# EAGLE design megamon (EAGLE 9.6.2)
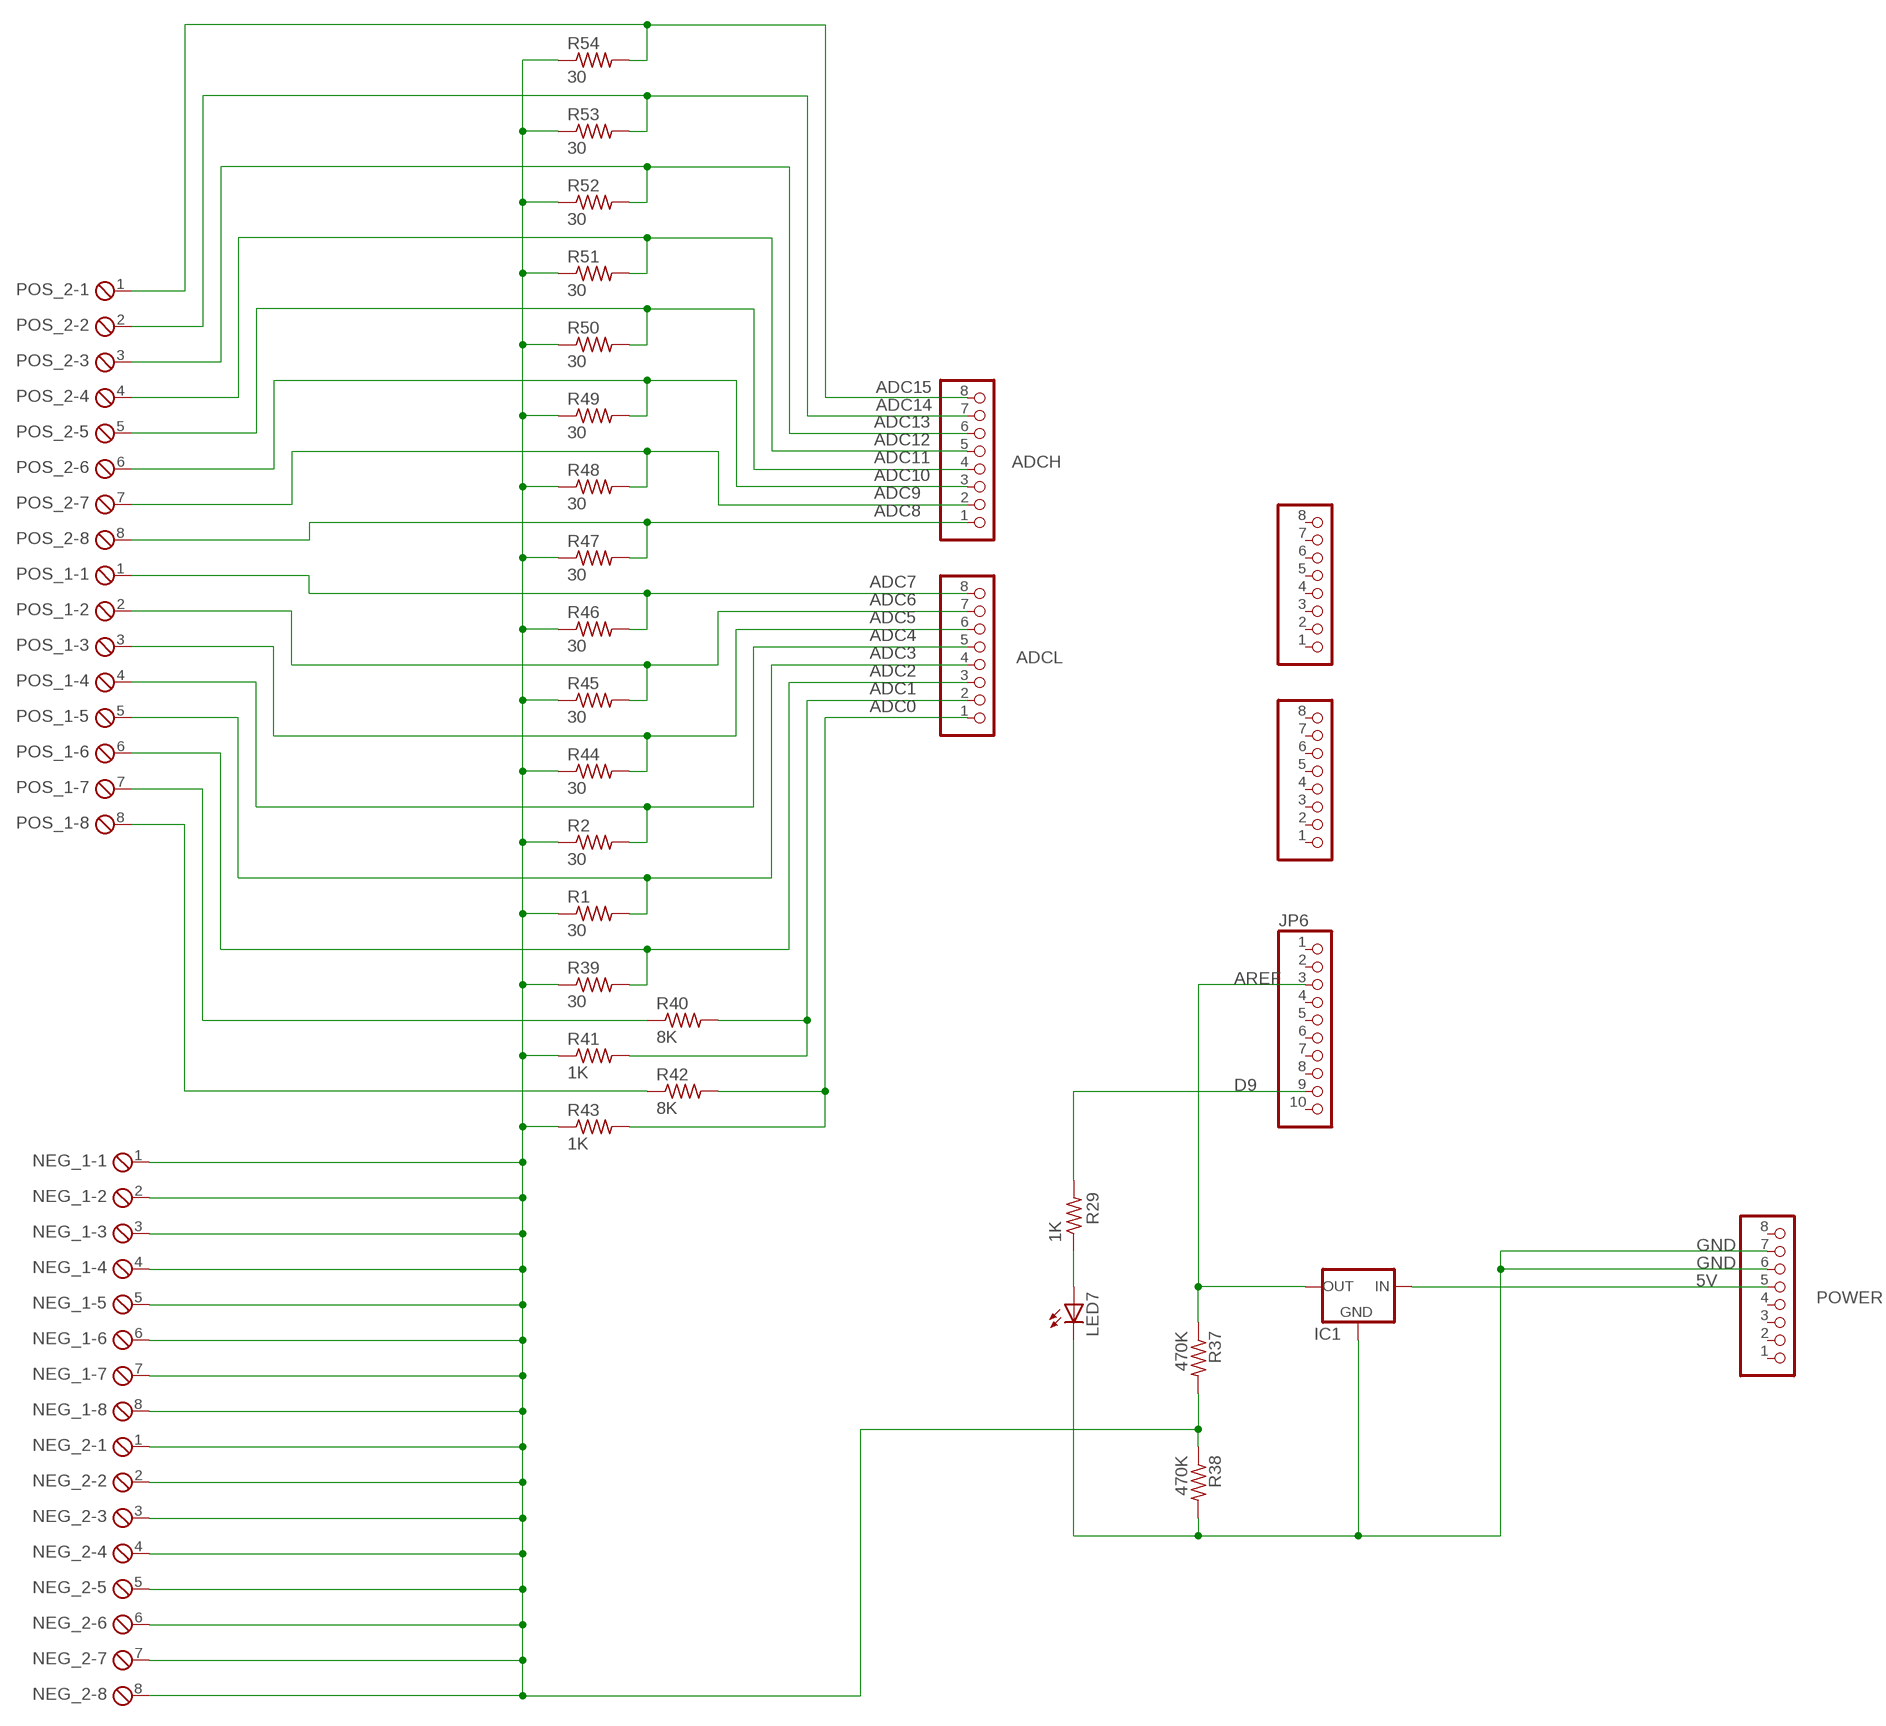
[diagram p0: schematic, sheet 1]

## Parts
ADCH  PINHD-1X8  [1X08]
ADCL  PINHD-1X8  [1X08]
COMMUNICATION  FH254-108DF08500V  0058_FH254-108DF08500V  [1X08]
IC1  MCP1700INLINE  [TO92-INLINE]
JP6  FH254-110DF08500V  1216_FH254-110DF08500T30  [1X10]
LED7  green  LED3MM  [LED3MM]
NEG_1  MPT8  [8POL254]
NEG_2  MPT8  [8POL254]
POS_1  MPT8  [8POL254]
POS_2  MPT8  [8POL254]
POWER  PINHD-1X8  [1X08]
PWML  FH254-108DF08500V  1218_FH254-108DF08500T20  [1X08]
R1  30  R-US_0204/7  [0204/7]
R2  30  R-US_0204/7  [0204/7]
R29  1K  R-US_0204/7  [0204/7]
R37  470K  R-US_0204/7  [0204/7]
R38  470K  R-US_0204/7  [0204/7]
R39  30  R-US_0204/7  [0204/7]
R40  8K  R-US_0204/7  [0204/7]
R41  1K  R-US_0204/7  [0204/7]
R42  8K  R-US_0204/7  [0204/7]
R43  1K  R-US_0204/7  [0204/7]
R44  30  R-US_0204/7  [0204/7]
R45  30  R-US_0204/7  [0204/7]
R46  30  R-US_0204/7  [0204/7]
R47  30  R-US_0204/7  [0204/7]
R48  30  R-US_0204/7  [0204/7]
R49  30  R-US_0204/7  [0204/7]
R50  30  R-US_0204/7  [0204/7]
R51  30  R-US_0204/7  [0204/7]
R52  30  R-US_0204/7  [0204/7]
R53  30  R-US_0204/7  [0204/7]
R54  30  R-US_0204/7  [0204/7]

## Nets
5V [power usb]: IC1.2(IN) POWER.5
ADC0: ADCL.1 R42.2 R43.2
ADC1: ADCL.2 R40.2 R41.2
ADC2: ADCL.3 POS_1.6 R39.2
ADC3: ADCL.4 POS_1.5 R1.2
ADC4: ADCL.5 POS_1.4 R2.2
ADC5: ADCL.6 POS_1.3 R44.2
ADC6: ADCL.7 POS_1.2 R45.2
ADC7: ADCL.8 POS_1.1 R46.2
ADC8: ADCH.1 POS_2.8 R47.2
ADC9: ADCH.2 POS_2.7 R48.2
ADC10: ADCH.3 POS_2.6 R49.2
ADC11: ADCH.4 POS_2.5 R50.2
ADC12: ADCH.5 POS_2.4 R51.2
ADC13: ADCH.6 POS_2.3 R52.2
ADC14: ADCH.7 POS_2.2 R53.2
ADC15: ADCH.8 POS_2.1 R54.2
AREF: IC1.3(OUT) JP6.3 R37.1
D9: JP6.9 R29.2
GND: IC1.1(GND) LED7.K(C) POWER.6 POWER.7 R38.2
N$2: POS_1.7 R40.1
N$6: POS_1.8 R42.1
N$11: LED7.A R29.1
V_MID: NEG_1.1 NEG_1.2 NEG_1.3 NEG_1.4 NEG_1.5 NEG_1.6 NEG_1.7 NEG_1.8 NEG_2.1 NEG_2.2 NEG_2.3 NEG_2.4 NEG_2.5 NEG_2.6 NEG_2.7 NEG_2.8 R1.1 R2.1 R37.2 R38.1 R39.1 R41.1 R43.1 R44.1 R45.1 R46.1 R47.1 R48.1 R49.1 R50.1 R51.1 R52.1 R53.1 R54.1
Unconnected: COMMUNICATION.1 COMMUNICATION.2 COMMUNICATION.3 COMMUNICATION.4 COMMUNICATION.5 COMMUNICATION.6 COMMUNICATION.7 COMMUNICATION.8 JP6.1 JP6.2 JP6.4 JP6.5 JP6.6 JP6.7 JP6.8 JP6.10 POWER.1 POWER.2 POWER.3 POWER.4 POWER.8 PWML.1 PWML.2 PWML.3 PWML.4 PWML.5 PWML.6 PWML.7 PWML.8

## Library data of the parts
ADCH ADCL POWER = pinhead:PINHD-1X8: PIN HEADER
COMMUNICATION = Connettori:0058_FH254-108DF08500V: Female Connector strip for Arduino bases - 8x1 F V h 8,5 p2,54mm; MONTHLY_USAGE: _____; PART_NUMBER: FH254-108DF08500V; PRICE: _____; SUPPLIER: _____; TYPE: Connettori
IC1 = adafruit:MCP1700: VOLTAGE REGULATOR
JP6 = Connettori:1216_FH254-110DF08500T30: Female Connector strip for Arduino bases - 10x1 F V h 8,5 p2,54 serigrafato STRISCIA VUOTA; MONTHLY_USAGE: _____; PART_NUMBER: FH254-110DF08500T30; PRICE: _____; SUPPLIER: _____; TYPE: Connettori; VALUE: FH254-110DF08500T30
LED7 = adafruit:LED: LED OSRAM: - CHIPLED LG R971, LG N971, LY N971, LG Q971, LY Q971, LO R971, LY R971 LH N974, LH R974 LS Q976, LO Q976, LY Q976 LO Q996 - Hyper CHIPLED LW Q18S LB Q993, LB Q99A, LB R99A - SideLED LS A670, LO A670, LY A670, LG A670, LP A670 LB A673, LV A673, LT A673, LW A673 LH A674 LY A675 LS A676, LA A676, LO A676, LY A676, LW A676 LS A679, LY A679, LG A679 - Hyper Micro SIDELED® LS Y876, LA Y876, LO Y876, LY Y876 LT Y87S - SmartLED LW L88C, LW L88S LB L89C, LB L89S, LG L890 LS L89K, LO L89K, LY L89K LS L896, LA L896, LO L896, LY L896 - TOPLED LS T670, LO T670, LY T670, LG T670, LP T670 LSG T670, LSP T670, LSY T670, LOP T670, LYG T670 LG T671, LOG T671, LSG T671 LB T673, LV T673, LT T673, LW T673 LH T674 LS T676, LA T676, LO T676, LY T676, LB T676, LH T676, LSB T676, LW T676 LB T67C, LV T67C, LT T67C, LS T67K, LO T67K, LY T67K, LW E67C LS E67B, LA E67B, LO E67B, LY E67B, LB E67C, LV E67C, LT E67C LW T67C LS T679, LY T679, LG T679 LS T770, LO T770, LY T770, LG T770, LP T770 LB T773, LV T773, LT T773, LW T773 LH T774 LS E675, LA E675, LY E675, LS T675 LS T776, LA T776, LO T776, LY T776, LB T776 LHGB T686 LT T68C, LB T68C - Hyper Mini TOPLED® LB M676 - Mini TOPLED Santana® LG M470 LS M47K, LO M47K, LY M47K Source: http://www.osram.convergy.de/
NEG_1 NEG_2 POS_1 POS_2 = con-phoenix-254:MPT8: PHOENIX CONNECTOR; OC_FARNELL: unknown; OC_NEWARK: unknown
PWML = Connettori:1218_FH254-108DF08500T20: Female Connector strip for Arduino bases - 8x1 F V h 8,5 p2,54 serigrafato DIGITAL; MONTHLY_USAGE: _____; PART_NUMBER: FH254-108DF08500T20; PRICE: _____; SUPPLIER: _____; TYPE: Connettori; VALUE: FH254-108DF08500T20
R1 R2 R29 R37-R54 = rcl:R-US_: RESISTOR, American symbol; SPICEPREFIX: R

## Net classes
0 default: width 0.15 mm, drill 0.3 mm, clearance 0.15 mm
1 power: width 0.61 mm, drill 0.406 mm, clearance 0.203 mm
2 gnd: width 0.254 mm, drill 0.6 mm, clearance 0.254 mm
3 power usb: width 0.508 mm, drill 0.406 mm, clearance 0.203 mm

## Board
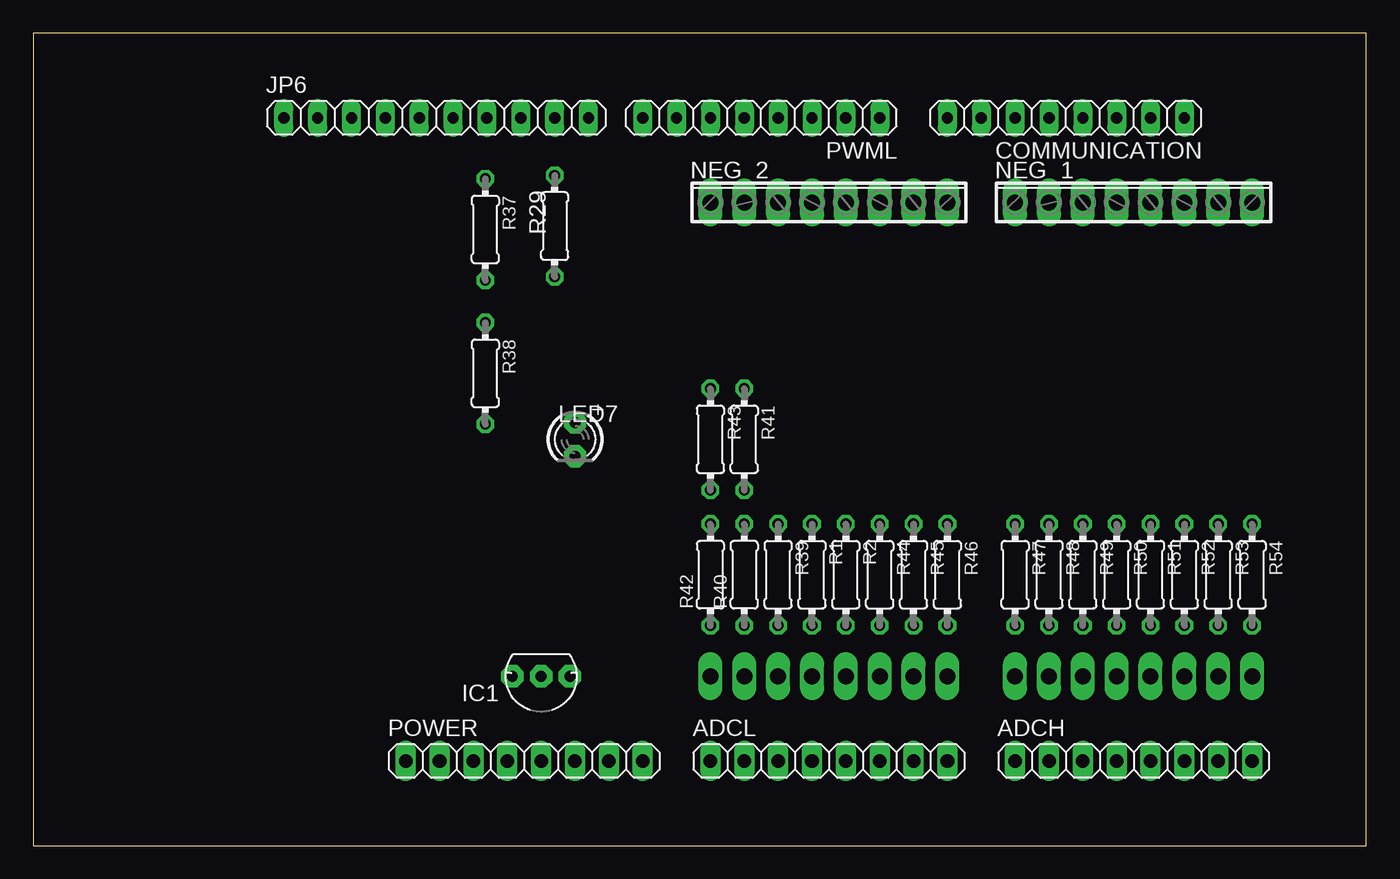
[diagram p1: board, top side]
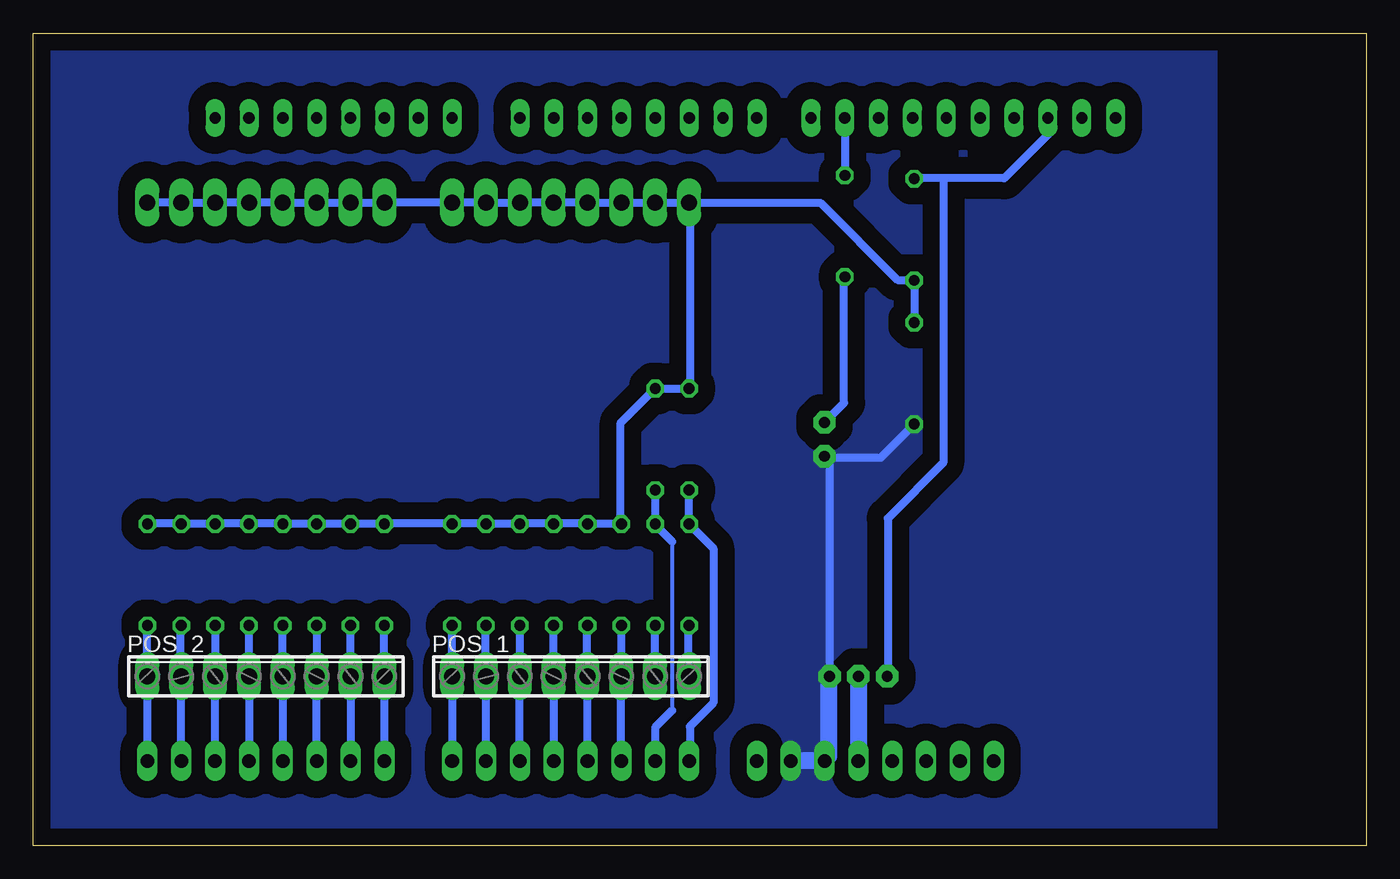
[diagram p2: board, bottom side, seen from below]

Size 100 x 60.95 mm. Coordinates in mm from the lower left corner, seen from the top.
Outline: 0,0 100,0 100,60.95 0,60.95 0,0
Copper layers (1*16): Top 0.035mm / dielectric 1.5mm / Bottom 0.035mm
Design rules "default *": minimum track width 6mil, minimum drill 0.35mm, track to track 8mil, track to pad 8mil, pad to pad 8mil, via to via 6mil, smd to smd 6mil, copper to edge 40mil, drill to drill 6mil, minimum pad ring 10mil, minimum via ring 8mil, stop-mask expansion 4mil, vias tented up to drill 0mil, thermal gap 10mil

### Footprints (pad centres in the part's own frame; a part is rotated, then mirrored left to right if it is on the bottom)
1X08 = drill 1.016 long: 1 -8.89,0; 2 -6.35,0; 3 -3.81,0; 4 -1.27,0; 5 1.27,0; 6 3.81,0; 7 6.35,0; 8 8.89,0
1X08' = drill 0.85 pad 1.422 long: 1 -8.89,0; 2 -6.35,0; 3 -3.81,0; 4 -1.27,0; 5 1.27,0; 6 3.81,0; 7 6.35,0; 8 8.89,0
TO92-INLINE = drill 0.813 pad 1.676 octagon: 1 -2.159,0; 2 0,0; 3 2.159,0
1X10 = drill 0.85 pad 1.422 long: 1 -11.43,0; 2 -8.89,0; 3 -6.35,0; 4 -3.81,0; 5 -1.27,0; 6 1.27,0; 7 3.81,0; 8 6.35,0; 9 8.89,0; 10 11.43,0
LED3MM = drill 0.813 pad 1.676 octagon: A -1.27,0; K 1.27,0
8POL254 = drill 1.2 long: 1 -8.89,0; 2 -6.35,0; 3 -3.81,0; 4 -1.27,0; 5 1.27,0; 6 3.81,0; 7 6.35,0; 8 8.89,0
0204/7 = drill 0.813 octagon: 1 -3.81,0; 2 3.81,0

### Placement (x,y rotation side)
ADCH  82.55,6.35 0 top
ADCL  59.69,6.35 0 top
COMMUNICATION  FH254-108DF08500V  [1X08']  77.47,54.61 180 top
IC1  38.1,12.7 180 top
JP6  30.23,54.61 0 top
LED7  40.64,30.48 270 top
NEG_1  82.55,48.26 0 top
NEG_2  59.69,48.26 0 top
POS_1  59.69,12.7 0 bottom
POS_2  82.55,12.7 0 bottom
POWER  36.83,6.35 0 top
PWML  FH254-108DF08500V  [1X08']  54.61,54.61 180 top
R1  58.42,20.32 270 top
R2  60.96,20.32 270 top
R29  39.12,46.48 90 top
R37  33.91,46.23 270 top
R38  33.91,35.43 270 top
R39  55.88,20.32 270 top
R40  53.34,20.32 90 top
R41  53.34,30.48 270 top
R42  50.8,20.32 90 top
R43  50.8,30.48 270 top
R44  63.5,20.32 270 top
R45  66.04,20.32 270 top
R46  68.58,20.32 270 top
R47  73.66,20.32 270 top
R48  76.2,20.32 270 top
R49  78.74,20.32 270 top
R50  81.28,20.32 270 top
R51  83.82,20.32 270 top
R52  86.36,20.32 270 top
R53  88.9,20.32 270 top
R54  91.44,20.32 270 top

### Tracks (layer width: path | path; a pad name or v marks a point on that pad's centre or on a via)
5V
  Bottom 1.27: IC1.2 POWER.5
ADC0
  Bottom 0.152: 50.83,24.15 R42.2 | 50.83,26.67 R43.2 | 50.75,6.4 ADCL.1
  Bottom 0.61: 50.83,26.67 50.83,24.15 | 50.75,6.4 50.75,8.94 48.97,10.72 48.97,22.3 R42.2
ADC1
  Bottom 0.152: 53.34,24.08 R40.2
  Bottom 0.305: 52.07,22.81 52.07,10.13
  Bottom 0.61: R41.2 R40.2 | ADCL.2 53.34,8.87 52.07,10.13 | 53.34,24.08 52.07,22.81
ADC2
  Bottom 0.152: 55.85,16.46 R39.2 | 55.85,12.72 POS_1.6 55.93,12.65 | 55.93,6.4 ADCL.3
  Bottom 0.61: 55.85,12.72 55.85,16.46 | 55.93,12.65 55.93,6.4
ADC3
  Bottom 0.152: 58.45,16.46 R1.2 | 58.45,12.72 POS_1.5 58.45,12.65 | 58.45,6.4 ADCL.4
  Bottom 0.61: 58.45,12.72 58.45,16.46 | 58.45,12.65 58.45,6.4
ADC4
  Bottom 0.61: R2.2 POS_1.4 ADCL.5
ADC5
  Bottom 0.152: 63.48,16.46 R44.2 | 63.48,12.72 POS_1.3 63.55,12.65 | 63.55,6.4 ADCL.6
  Bottom 0.61: 63.48,12.72 63.48,16.46 | 63.55,12.65 63.55,6.4
ADC6
  Bottom 0.152: 66.06,16.46 R45.2 | 66.06,12.72 POS_1.2 66.06,12.65 | 66.06,6.4 ADCL.7
  Bottom 0.61: 66.06,12.72 66.06,16.46 | 66.06,12.65 66.06,6.4
ADC7
  Bottom 0.61: R46.2 POS_1.1 ADCL.8
ADC8
  Bottom 0.152: 73.69,16.46 R47.2 | 73.69,12.72 POS_2.8 73.69,12.65 | 73.69,6.4 ADCH.1
  Bottom 0.61: 73.69,12.72 73.69,16.46 | 73.69,12.65 73.69,6.4
ADC9
  Bottom 0.61: R48.2 POS_2.7 ADCH.2
ADC10
  Bottom 0.152: 78.72,16.46 R49.2 | 78.72,12.72 POS_2.6 78.79,12.65 | 78.79,6.4 ADCH.3
  Bottom 0.61: 78.72,12.72 78.72,16.46 | 78.79,12.65 78.79,6.4
ADC11
  Bottom 0.152: 81.31,16.46 R50.2 | 81.31,12.72 POS_2.5 81.31,12.65 | 81.31,6.4 ADCH.4
  Bottom 0.61: 81.31,12.72 81.31,16.46 | 81.31,12.65 81.31,6.4
ADC12
  Bottom 0.61: R51.2 POS_2.4 ADCH.5
ADC13
  Bottom 0.152: 86.33,16.46 R52.2 | 86.33,12.72 POS_2.3 86.41,12.65 | 86.41,6.4 ADCH.6
  Bottom 0.61: 86.33,12.72 86.33,16.46 | 86.41,12.65 86.41,6.4
ADC14
  Bottom 0.152: 88.92,16.46 R53.2 | 88.92,12.72 POS_2.2 88.92,12.65 | 88.92,6.4 ADCH.7
  Bottom 0.61: 88.92,12.72 88.92,16.46 | 88.92,12.65 88.92,6.4
ADC15
  Bottom 0.61: R54.2 POS_2.1 ADCH.8
AREF
  Bottom 0.152: 33.91,50.06 R37.1 | 35.89,12.72 IC1.3
  Bottom 0.61: 31.73,50.06 27.15,50.06 23.88,53.34 JP6.3 | 31.73,50.06 33.91,50.06 | 35.89,12.72 35.89,24.56 31.73,28.73 31.73,50.06
D9
  Bottom 0.152: 39.09,50.29 R29.2 | 39.09,54.56 JP6.9
  Bottom 0.61: 39.09,54.56 39.09,50.29
GND
  Bottom 0.152: 40.69,6.4 POWER.6 40.62,6.4 40.31,6.71 | 43.13,6.4 POWER.7 | 40.31,12.65 IC1.1 40.23,12.72 | 40.54,29.11 40.23,29.11 LED7.K 40.54,29.11
  Bottom 0.61: R38.2 36.42,29.11 40.23,29.11 40.23,12.72
  Bottom 1.27: 43.13,6.4 40.69,6.4 | 40.31,6.71 40.31,12.65
  pour Bottom (isolate 1.27, no thermals): 13.97,60.96 99.06,60.96 99.06,0 11.43,0 11.43,60.96
N$2
  Bottom 0.61: POS_1.7 R40.1
N$6
  Bottom 0.152: 50.83,16.46 R42.1 | 50.83,12.72 POS_1.8
  Bottom 0.61: 50.83,12.72 50.83,16.46
N$11
  Bottom 0.152: 39.17,42.67 R29.1
  Bottom 0.61: 39.17,42.67 39.17,33.22 LED7.A
V_MID
  Bottom 0.152: 86.41,24.15 R52.1 86.33,24.15 | 88.85,24.15 R53.1 88.92,24.15 | 91.44,24.15 R54.1 | 73.69,24.15 R47.1 73.61,24.15 | 78.79,24.15 R49.1 78.72,24.15 | 81.23,24.15 R50.1 81.31,24.15 | 76.2,24.15 R48.1 | 83.82,24.15 R51.1 | 63.55,24.15 R44.1 63.48,24.15 | 65.99,24.15 R45.1 66.06,24.15 | 55.93,24.15 R39.1 55.93,24.23 | 58.37,24.15 R1.1 58.45,24.15 | 60.96,24.15 R2.1 | 68.58,24.15 R46.1 | 86.41,48.23 NEG_1.6 86.33,48.23 | 88.85,48.23 NEG_1.7 88.92,48.23 | 91.44,48.23 NEG_1.8 | 73.69,48.23 NEG_1.1 73.61,48.23 | 78.79,48.23 NEG_1.3 78.72,48.23 | 81.23,48.23 NEG_1.4 81.31,48.23 | 76.2,48.23 NEG_1.2 | 83.82,48.23 NEG_1.5 | 63.55,48.23 NEG_2.6 63.48,48.23 | 65.99,48.23 NEG_2.7 66.06,48.23 | 50.83,48.23 NEG_2.1 | 55.93,48.23 NEG_2.3 55.85,48.23 | 58.37,48.23 NEG_2.4 58.45,48.23 | 53.34,48.23 NEG_2.2 | 33.91,42.44 R37.2 | 50.75,48.23 NEG_2.1 | 60.96,48.23 NEG_2.5 | 68.58,48.23 NEG_2.8 | 50.75,34.29 R43.1 | 50.75,48.16 NEG_2.1
  Bottom 0.61: 88.85,24.15 86.41,24.15 | 88.92,24.15 91.44,24.15 | 73.69,24.15 76.2,24.15 78.72,24.15 | 81.23,24.15 78.79,24.15 | 81.31,24.15 83.82,24.15 86.33,24.15 | 65.99,24.15 63.55,24.15 | 66.06,24.15 68.58,24.15 73.61,24.15 | R43.1 R41.1 53.37,34.29 55.93,31.72 55.93,24.23 | 58.37,24.15 55.93,24.15 | 58.45,24.15 60.96,24.15 63.48,24.15 | 88.85,48.23 86.41,48.23 | 88.92,48.23 91.44,48.23 | 73.69,48.23 76.2,48.23 78.72,48.23 | 81.23,48.23 78.79,48.23 | 81.31,48.23 83.82,48.23 86.33,48.23 | 65.99,48.23 63.55,48.23 | 66.06,48.23 68.58,48.23 73.61,48.23 | R37.2 R38.1 | 50.83,48.23 53.34,48.23 55.85,48.23 | 58.37,48.23 55.93,48.23 | 58.45,48.23 60.96,48.23 63.48,48.23 | 33.91,42.44 35.15,42.44 40.95,48.23 50.75,48.23 | 50.75,48.16 50.75,34.29